# Altium schematic sheet uart_adm3222.SchDoc
size A4
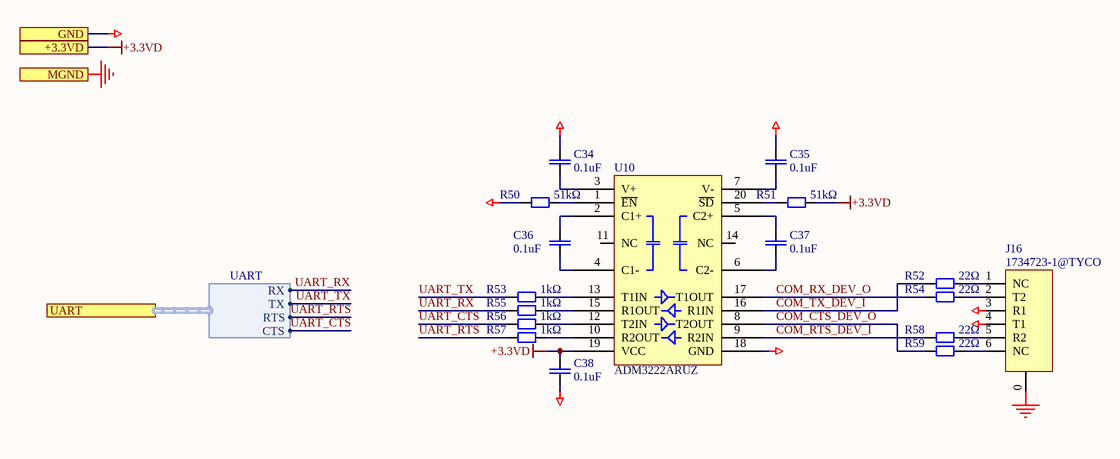
[diagram p0: uart_adm3222.SchDoc]

## Parts
C34  0.1uF  [CAPC2012N]
C35  0.1uF  [CAPC2012N]
C36  0.1uF  [CAPC2012N]
C37  0.1uF  [CAPC2012N]
C38  0.1uF  [CAPC2012N]
J16  1734723-1@TYCO  [RJ14]
R50  51kΩ  [RESC2012N]
R51  51kΩ  [RESC2012N]
R52  22Ω  [RESC1608N]
R53  1kΩ  [RESC2012N]
R54  22Ω  [RESC1608N]
R55  1kΩ  [RESC2012N]
R56  1kΩ  [RESC2012N]
R57  1kΩ  [RESC2012N]
R58  22Ω  [RESC1608N]
R59  22Ω  [RESC1608N]
U10  ADM3222ARUZ  [SOP65P640X110-20N]

## Ports
+3.3VD, GND, MGND, UART (harness UART)

## Harnesses
UART: RX, TX, RTS, CTS

## Nets
+3.3VD: C38.2 R51.2 U10.19(VCC) ; port +3.3VD
GND: C34.2 C35.2 C38.1 J16.3(R1) J16.4(T1) R50.1 U10.18(GND) ; port GND
MGND: J16.0 ; port MGND
COM_CTS_DEV_O: R59.1 U10.8(T2OUT)
COM_RTS_DEV_I: R58.1 U10.9(R2IN)
COM_RX_DEV_O: R54.1 U10.17(T1OUT)
COM_TX_DEV_I: R52.1 U10.16(R1IN)
UART_CTS: R56.1 ; port UART.CTS
UART_RTS: R57.1 ; port UART.RTS
UART_RX: R55.1 ; port UART.RX
UART_TX: R53.1 ; port UART.TX
NetC34_1: C34.1 U10.3(V+)
NetC35_1: C35.1 U10.7(V-)
NetC36_1: C36.1 U10.4(C1-)
NetC36_2: C36.2 U10.2(C1+)
NetC37_1: C37.1 U10.6(C2-)
NetC37_2: C37.2 U10.5(C2+)
NetJ16_1: J16.1(NC) R52.2
NetJ16_2: J16.2(T2) R54.2
NetJ16_5: J16.5(R2) R58.2
NetJ16_6: J16.6(NC) R59.2
NetR50_2: R50.2 U10.1(~{EN})
NetR51_1: R51.1 U10.20(~{SD})
NetR53_2: R53.2 U10.13(T1IN)
NetR55_2: R55.2 U10.15(R1OUT)
NetR56_2: R56.2 U10.12(T2IN)
NetR57_2: R57.2 U10.10(R2OUT)

Not connected (* = marked no-connect by the designer): U10 11(NC) 14(NC)

## Library data of the parts
C34-C38 = CAPC: Generic ceramic SMD capacitor; Pkg: 0805; Maintainer: Evgeniy Kotov; SMD Solders: 2; THD Solders: 0; PartField: 0.1uF; Last Change Data: 06.03.2017; Release Date: 06.03.2017; Value: 0.1uF
J16 = RJ-14: Pkg: RJ14-6p; SMD Solders: 0; THD Solders: 10; PartField: 1734723-1@TYCO; Value: 1734723-1@TYCO
R50 R51 R53 R55-R57 = RESC: Resistor, Generic, SMD; Pkg: 0805; Maintainer: Evgeniy Kotov; SMD Solders: 2; THD Solders: 0; Release Date: 06.03.2017; Last Change Data: 09.03.2017
  R50 R51: PartField: 51kΩ; Value: 51kΩ
  R53 R55-R57: PartField: 1kΩ; Value: 1kΩ
R52 R54 R58 R59 = RESC: Resistor, Generic, SMD; Pkg: 0603; Maintainer: Evgeniy Kotov; SMD Solders: 2; THD Solders: 0; PartField: 22Ω; Release Date: 06.03.2017; Last Change Data: 09.03.2017; Value: 22Ω
U10 = ADM3222ARU: RS232; Pkg: TSSOP-20; SMD Solders: 20; THD Solders: 0; Vendor: Analog Devices; ComponentLink1URL: https://www.analog.com/media/en/technical-documentation/data-sheets/ADM3202_3222_1385.pdf; Last Change Date: 24.05.2019; PartField: ADM3222ARUZ; Value: ADM3222